# Altium schematic sheet Sheet5.SchDoc: Контроллер нетривиального станка с ЧПУ
size 420 x 297 mm; Author: Барков; CompanyName: BarCockSemenConductor; DrawnBy: Барков; Organization: BarCockSemenConductor; DocumentNumber: хххххххх; SheetNumber: 5; SheetTotal: 5; DocumentName: Sheet1.SCHDOC
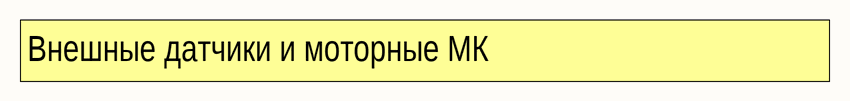
[diagram p0: Sheet5.SchDoc]

## Notes on the sheet
- Внешные датчики и моторные МК
- Подп. и дата
- Инв.№ дубл.
- Взам. инв. №
- Инв № подл.
- Изм.
- Лист
- № докум.
- Подп.
- Дата
- Копировал
- Формат А3